# Altium schematic sheet 1_Power.SchDoc
size A4; SheetNumber: 1; SheetTotal: 4
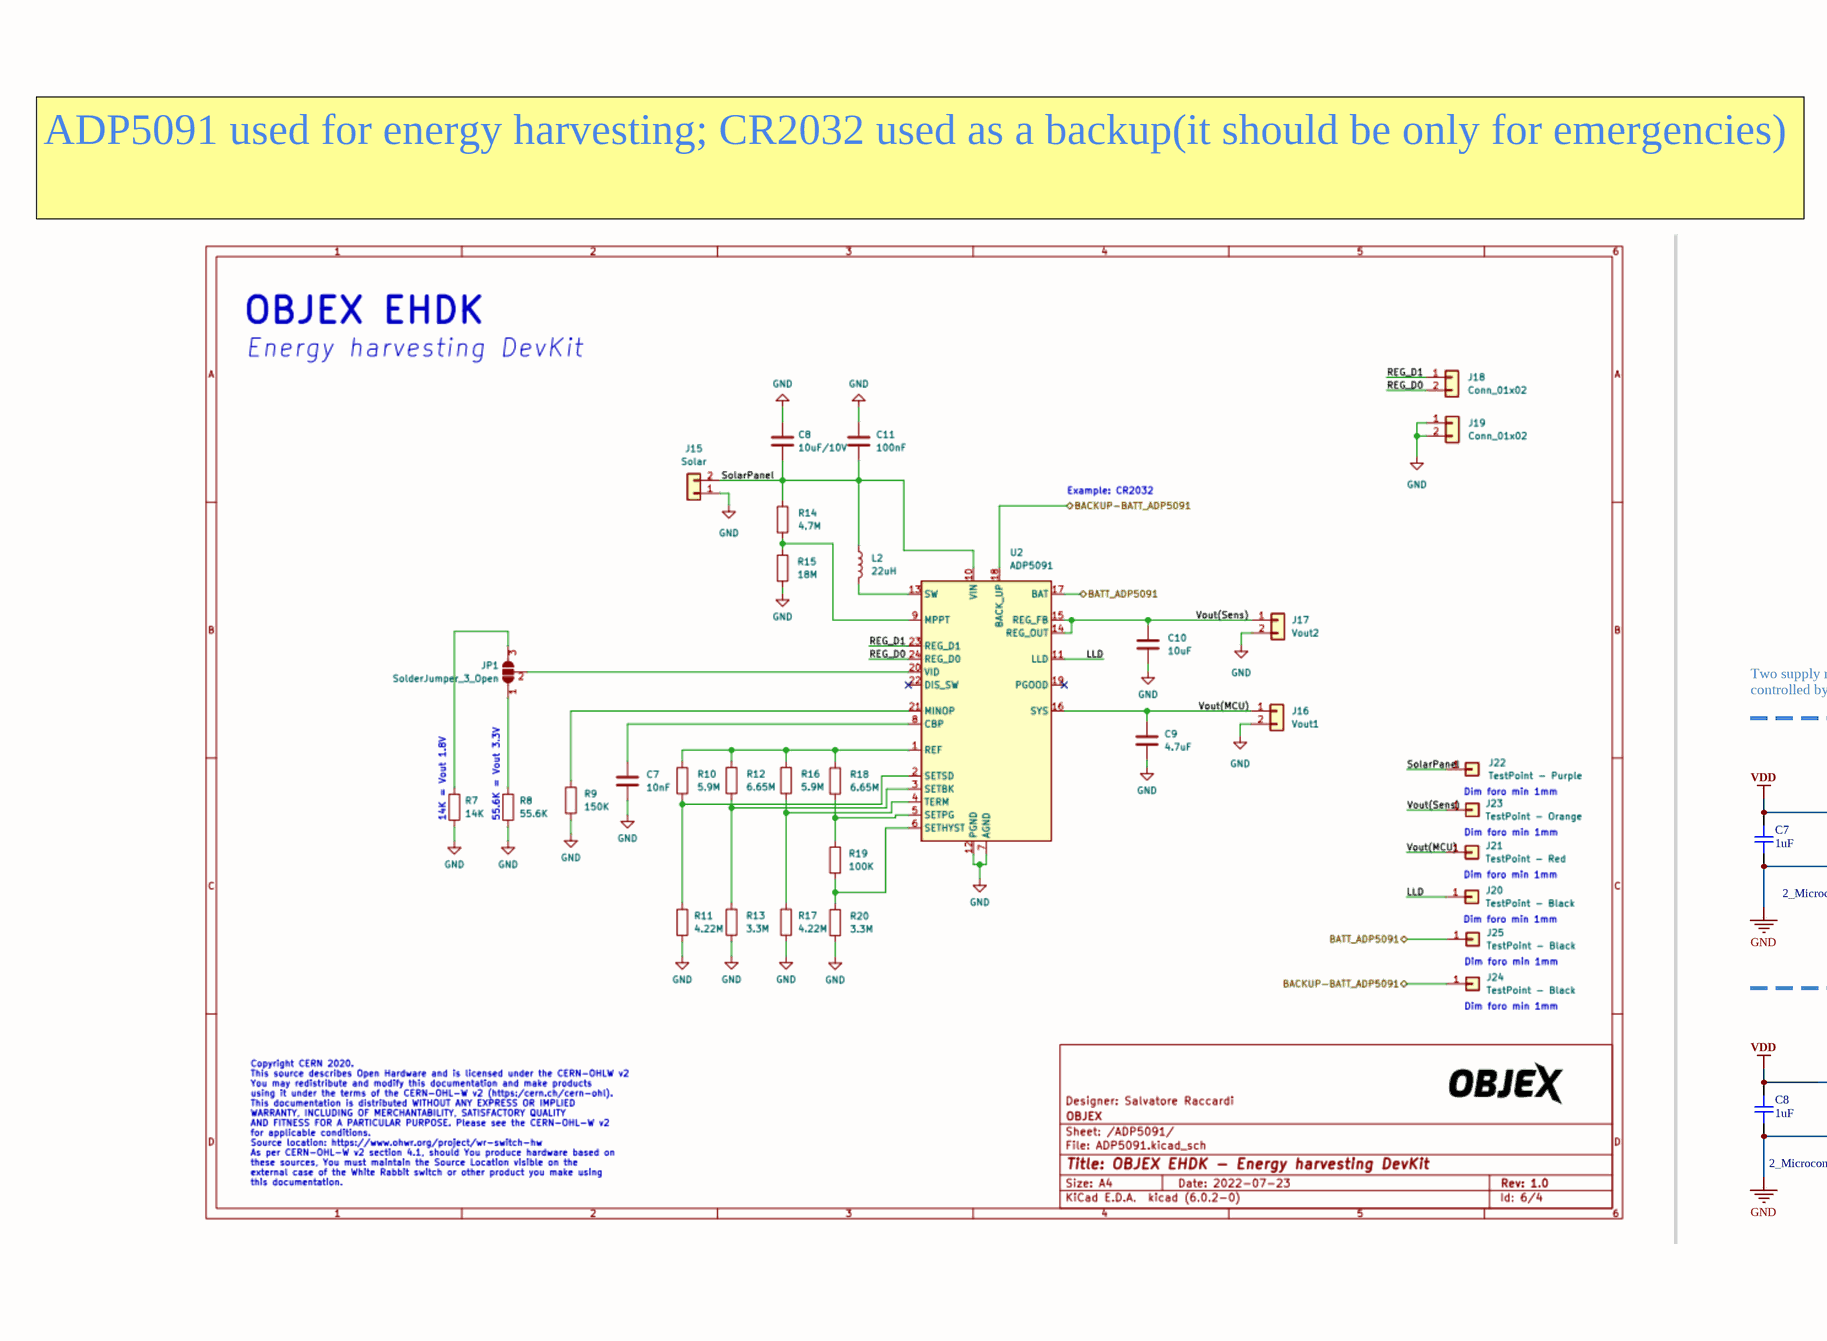
[diagram p0: 1_Power.SchDoc, left]
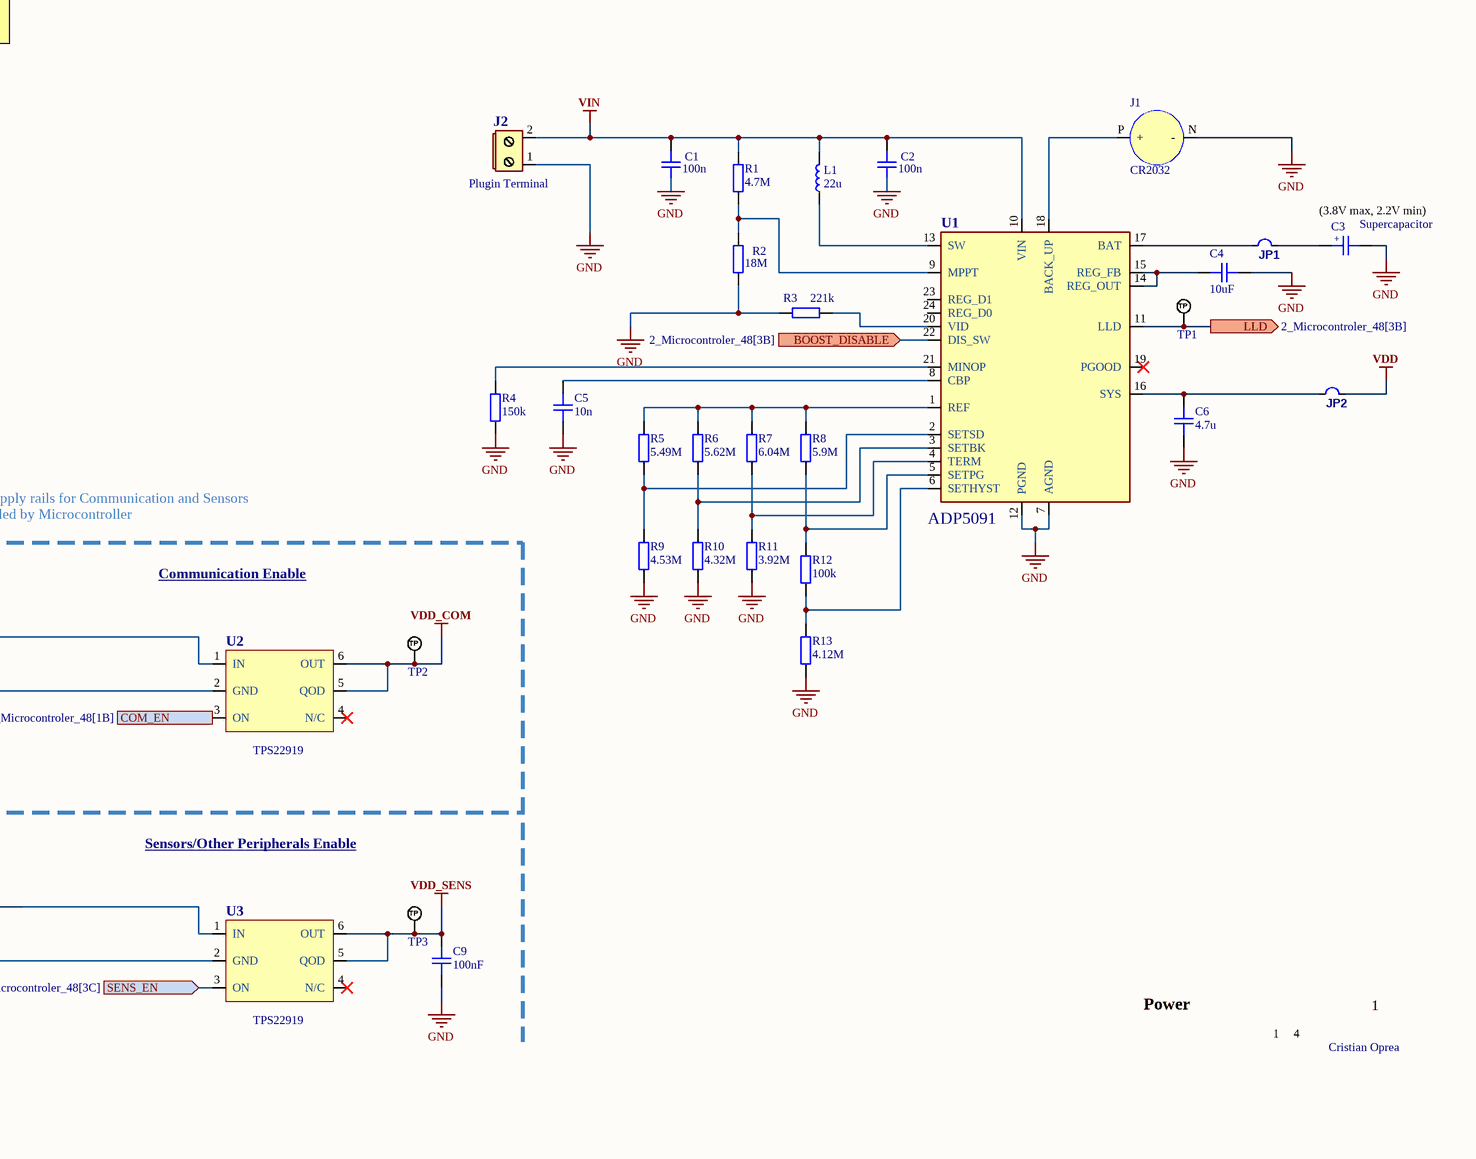
[diagram p1: 1_Power.SchDoc, middle]
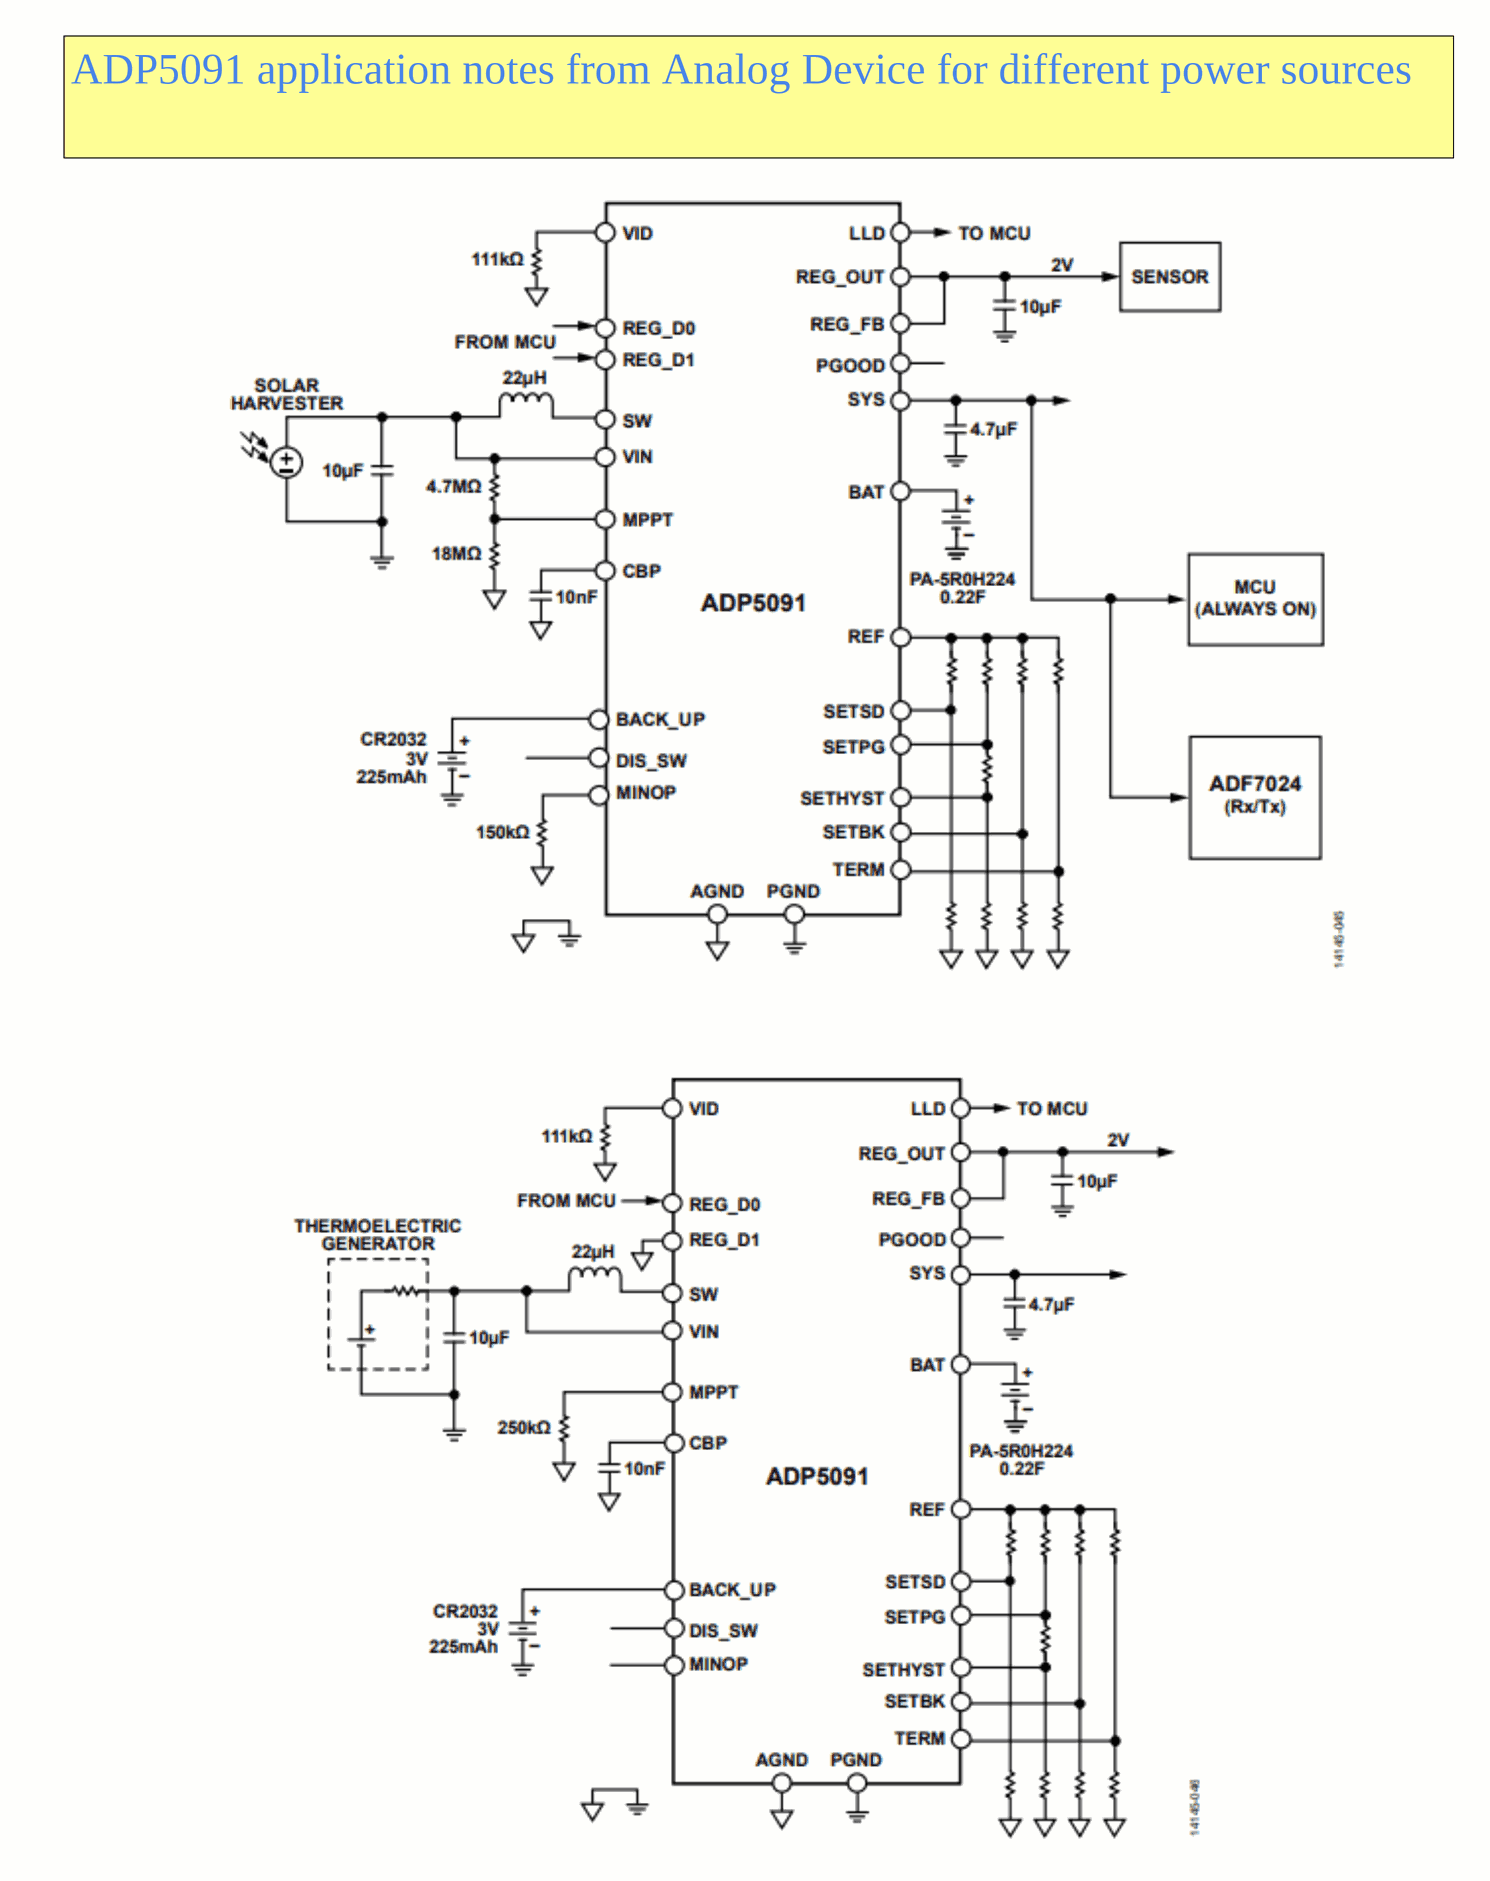
[diagram p2: 1_Power.SchDoc, right]

## Parts
C1  100n  [C0603]
C2  100n  [C0603]
C3  Supercapacitor  [CAP_POL_8x16x3.5]
C4  10uF  [C0805]
C5  10n  [C0603]
C6  4.7u  [C0603]
C7  1uF  [C0603]
C8  1uF  [C0603]
C9  100nF  [C0603]
J1  CR2032  [BAT_CR2032-BS-6-1]
J2  Plugin Terminal  [2.54_pluggable_terminal]
JP1  JUMPER  [HEADER_1x2_2.54]  (value not drawn)
JP2  JUMPER  [HEADER_1x2_2.54]  (value not drawn)
L1  22u  [IND_3.2_4]
R1  4.7M  [R0603]
R2  18M  [R0603]
R3  221k  [R0603]
R4  150k  [R0603]
R5  5.49M  [R0603]
R6  5.62M  [R0603]
R7  6.04M  [R0603]
R8  5.9M  [R0603]
R9  4.53M  [R0603]
R10  4.32M  [R0603]
R11  3.92M  [R0603]
R12  100k  [R0603]
R13  4.12M  [R0603]
TP1  TP_NOBOM  [TEST_PAD_THD]  (value not drawn)  (no BOM)
TP2  TP_NOBOM  [TEST_PAD_THD]  (value not drawn)  (no BOM)
TP3  TP_NOBOM  [TEST_PAD_THD]  (value not drawn)  (no BOM)
U1  ADP5091  [LFCSP-24]
U2  TPS22919  [SC70-6]
U3  TPS22919  [SC70-6]

## Ports
BOOST_DISABLE (in, see 2_Microcontroler_48[3B]), COM_EN (in, see 2_Microcontroler_48[1B]), LLD (out, see 2_Microcontroler_48[3B]), SENS_EN (in, see 2_Microcontroler_48[3C])

## Nets
GND: C1.1 C2.1 C3.2 C4.2 C5.1 C6.1 C7.1 C8.1 C9.1 J1.N(-) J2.1 R2.1 R3.1 R4.1 R9.1 R10.1 R11.1 R13.1 U1.7(AGND) U1.12(PGND) U2.2(GND) U3.2(GND)
VDD: C7.2 C8.2 JP2.2 U2.1(IN) U3.1(IN)
VDD_COM: TP2.1(TP) U2.5(QOD) U2.6(OUT)
VDD_SENS: C9.2 TP3.1(TP) U3.5(QOD) U3.6(OUT)
VIN: C1.2 C2.2 J2.2 L1.2 R1.2 U1.10(VIN)
BOOST_DISABLE: U1.22(DIS_SW) ; port BOOST_DISABLE
COM_EN: U2.3(ON) ; port COM_EN
LLD: TP1.1(TP) U1.11(LLD) ; port LLD
SENS_EN: U3.3(ON) ; port SENS_EN
NetC3_1: C3.1 JP1.2
NetC4_1: C4.1 U1.14(REG_OUT) U1.15(REG_FB)
NetC5_2: C5.2 U1.8(CBP)
NetC6_2: C6.2 JP2.1 U1.16(SYS)
NetJ1_P: J1.P(+) U1.18(BACK_UP)
NetJP1_1: JP1.1 U1.17(BAT)
NetL1_1: L1.1 U1.13(SW)
NetR1_1: R1.1 R2.2 U1.9(MPPT)
NetR3_2: R3.2 U1.20(VID)
NetR4_2: R4.2 U1.21(MINOP)
NetR5_1: R5.1 R9.2 U1.2(SETSD)
NetR5_2: R5.2 R6.2 R7.2 R8.2 U1.1(REF)
NetR6_1: R6.1 R10.2 U1.3(SETBK)
NetR7_1: R7.1 R11.2 U1.4(TERM)
NetR8_1: R8.1 R12.2 U1.5(SETPG)
NetR12_1: R12.1 R13.2 U1.6(SETHYST)

Not connected (* = marked no-connect by the designer): U1 19(PGOOD)* 23(REG_D1) 24(REG_D0); U2 4(N/C)*; U3 4(N/C)*

## Notes on the sheet
- ADP5091 application notes from Analog Device for different power sources
- ADP5091 used for energy harvesting; CR2032 used as a backup(it should be only for emergencies)
- (near J2) 0.5V to 3.3V input
- R1 not populated for TEG generators
- (near C3) (3.8V max, 2.2V min)
- VID resistor for setting output voltage
- Low Light Density (low voltage at input), PGOOD is HIGH only when output voltage is higher than the set voltage
- Two supply rails for Communication and Sensors controlled by Microcontroller
- Vsetbk = 2.3V (backup supply swith on threshold)(higher than stop discharge threshold)
- (near R11) Vbat_term = 3.8V (stop charge threshold) (hybrid supercapacitor with lithium)
- Communication Enable
- Vsetsd = 2.2V (stop discharge threshold) (hybrid supercapacitor with lithium)
- Vsetbkhys = (hysteresis threshold)
- (near JP2) Floating: VOUT = 2.5 V
  RVID = 7 kΩ: VOUT = 1.5 V
  RVID = 14 kΩ: VOUT = 1.8 V
  RVID = 27.7 kΩ: VOUT = 3.6 V
  RVID = 55.6 kΩ:VOUT = 3.3 V
  RVID = 111 kΩ: VOUT = 2.0 V
  RVID = 221 kΩ: VOUT = 3.0 V
  RVID = 442 kΩ: VOUT = 2.8 V
- (near R13) Vsetpg = 2.4V (power good threshold) (voltage output is higher than this threshold)
- Sensors/Other Peripherals Enable
- Power
- 1
- 4
- Cristian Oprea
- (in symbol Supercapacitor) +

## Library data of the parts
C1 C2 C5-C9 = CAP_0603: Capacitor SMD 0603; Manufacturer: *; Manufacturer Part Number: *; Distributor Link: *; LCSC: *; Rating: *; Dielectric: *
C4 = CAP_0805: Capacitor SMD 0805; Manufacturer: *; Manufacturer Part Number: *; Distributor Link: *; LCSC: *; Rating: *; Dielectric: *
J1 = CR2032-BS-6-1: CR2032 Coin Cell Battery Holder; Manufacturer: Q&J; Manufacturer Part Number: CR2032-BS-6-1
J2 = Power_Connector: Screw terminal or plug terminal for power
JP1 JP2 = JUMPER: *; PackageReference: *; Manufacturer Part Number 1: *
L1 = IND_1008: Inductor SMD 1008
R1-R13 = RES_0603: Resistor SMD 0603; Manufacturer: *; Manufacturer Part Number: *; Distributor Link: *; LCSC: *
TP1-TP3 = TEST_POINT_RND_1MM: Test Point Round 1mm (NO BOM)
U1 = ADP5091: Ultralow Power Energy Harvester PMUs / with MPPT and Charge Management and BAckup Supply
U2 U3 = TPS22919: 5.5-V, 1.5-A, 90-mΩ load switch with adjustable output discharge
C3 = Supercapacitor: Manufacturer: *; Manufacturer Part Number: *; Distributor Link: *; LCSC: *